# Altium schematic sheet XTIDA-010086_Control Card_28379.SchDoc: Control card
size 558 x 431 mm; Date: Not shown in title block; ApprovedBy: Not shown in title block; CheckedBy: Not shown in title block; Author: Not shown in title block; CompanyName: Not shown in title block; DrawnBy: Jeff Xie; Engineer: Not shown in title block; Organization: Not shown in title block; Address1: Not shown in title block; Address2: Not shown in title block; Address3: Not shown in title block; Address4: Not shown in title block; DocumentNumber: 2; Revision: Use project parameter SCH_Rev; SheetNumber: 6; SheetTotal: 8; PageSetup: Record=PageOptions|CenterHorizontal=True|CenterVertical=True|PrintScale=1.00|XCorrection=1.00|YCorrection=1.00|PrintKind=0|BorderSize=5000000|LeftOffset=0|BottomOffset=0|Orientation=2|PaperLength=1000|PaperWidth=1000|Scale=100|PaperSource=15|PrintQuality=600|MediaType=1|DitherType=10|PaperKind=Letter|PrintScaleMode=1; CurrentTime: Not shown in title block; CurrentDate: Not shown in title block; Time: Not shown in title block; DocumentFullPathAndName: Not shown in title block; DocumentName: Not shown in title block; ModifiedDate: Not shown in title block; ImagePath: Not shown in title block
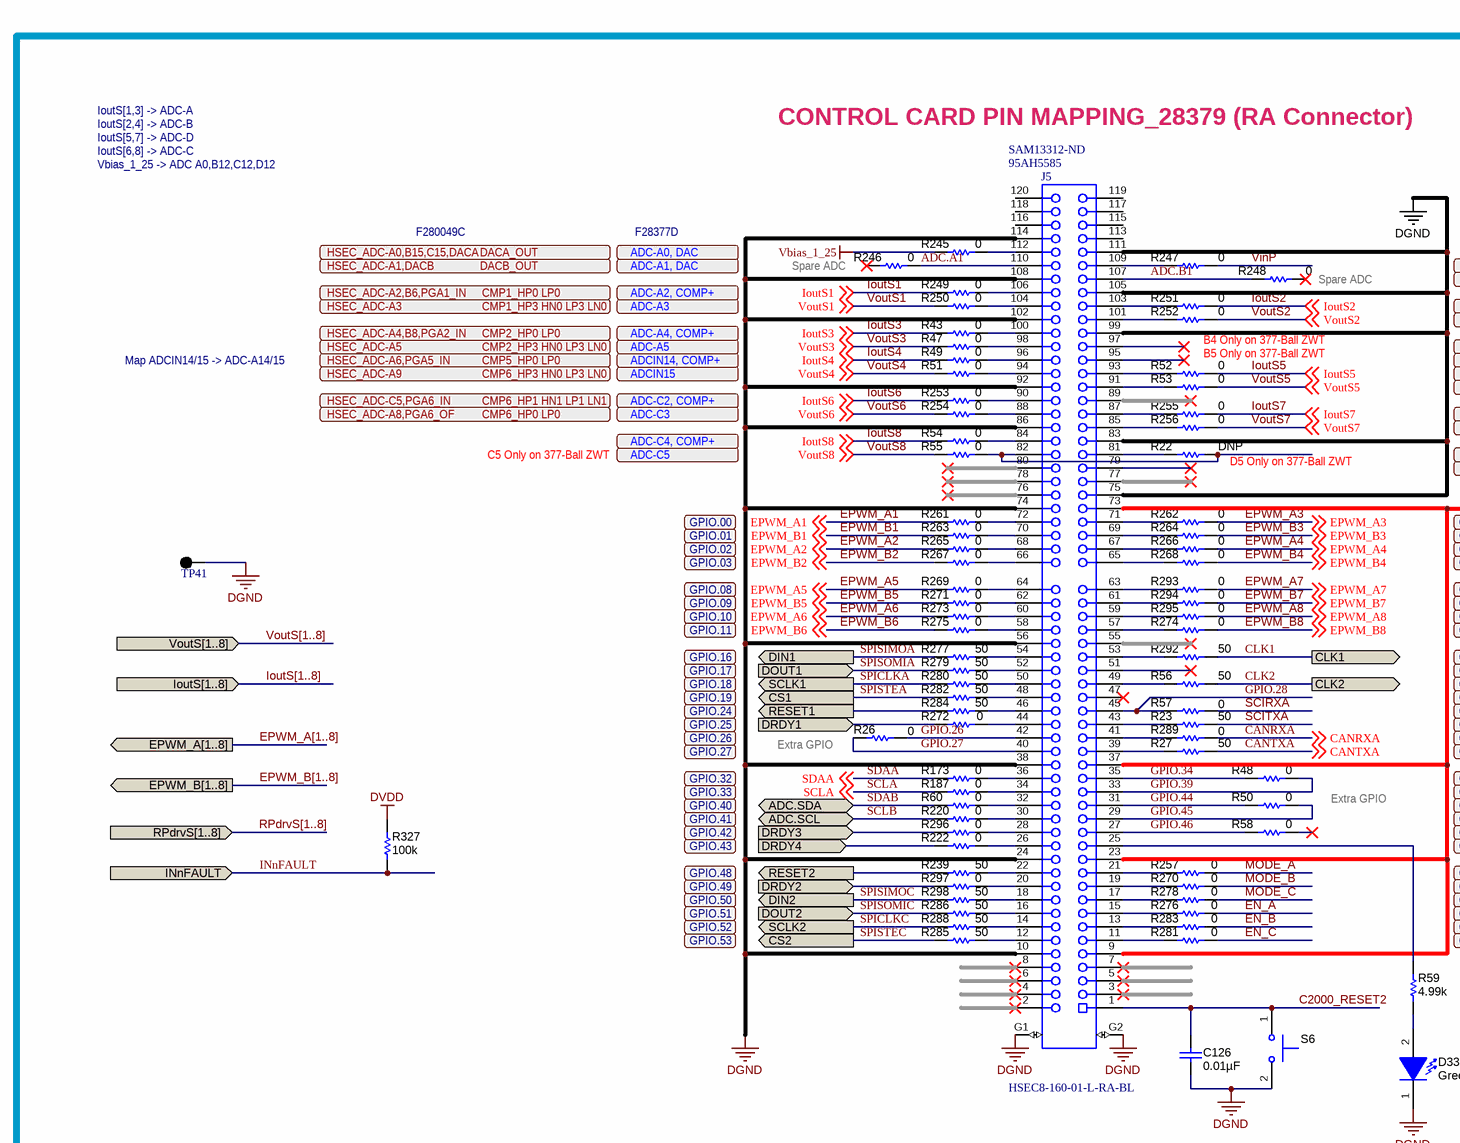
[diagram p0: XTIDA-010086_Control Card_28379.SchDoc, top left]
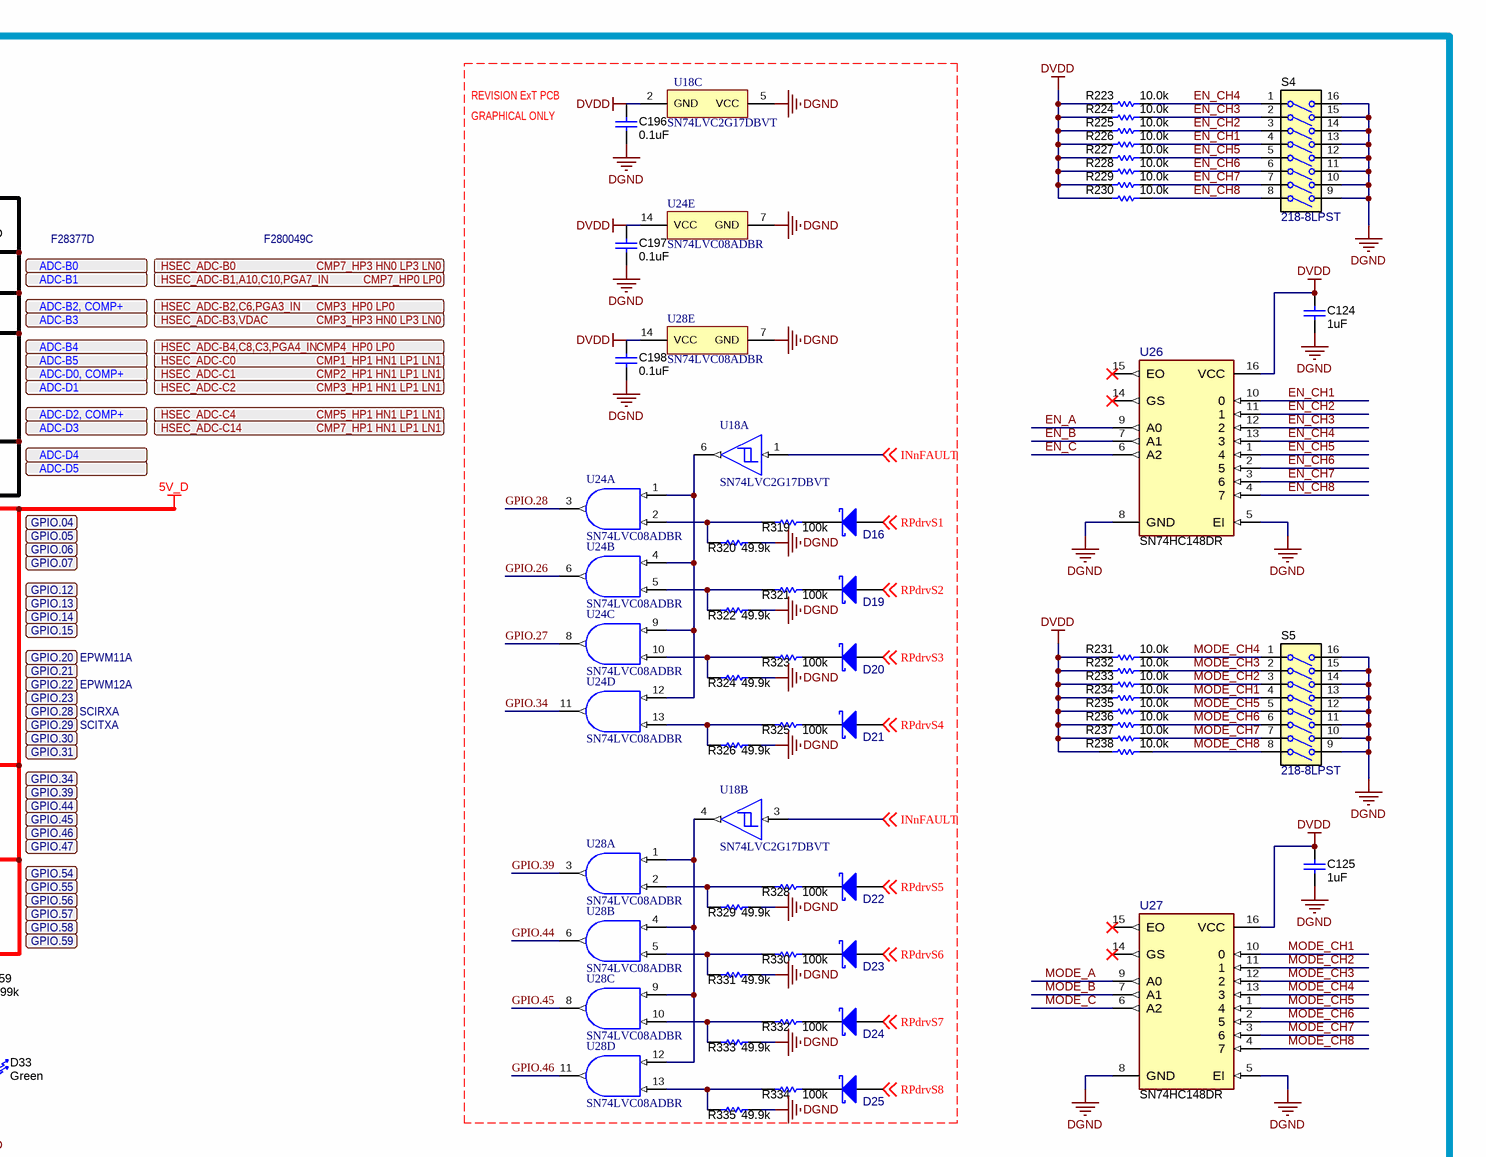
[diagram p1: XTIDA-010086_Control Card_28379.SchDoc, top right]
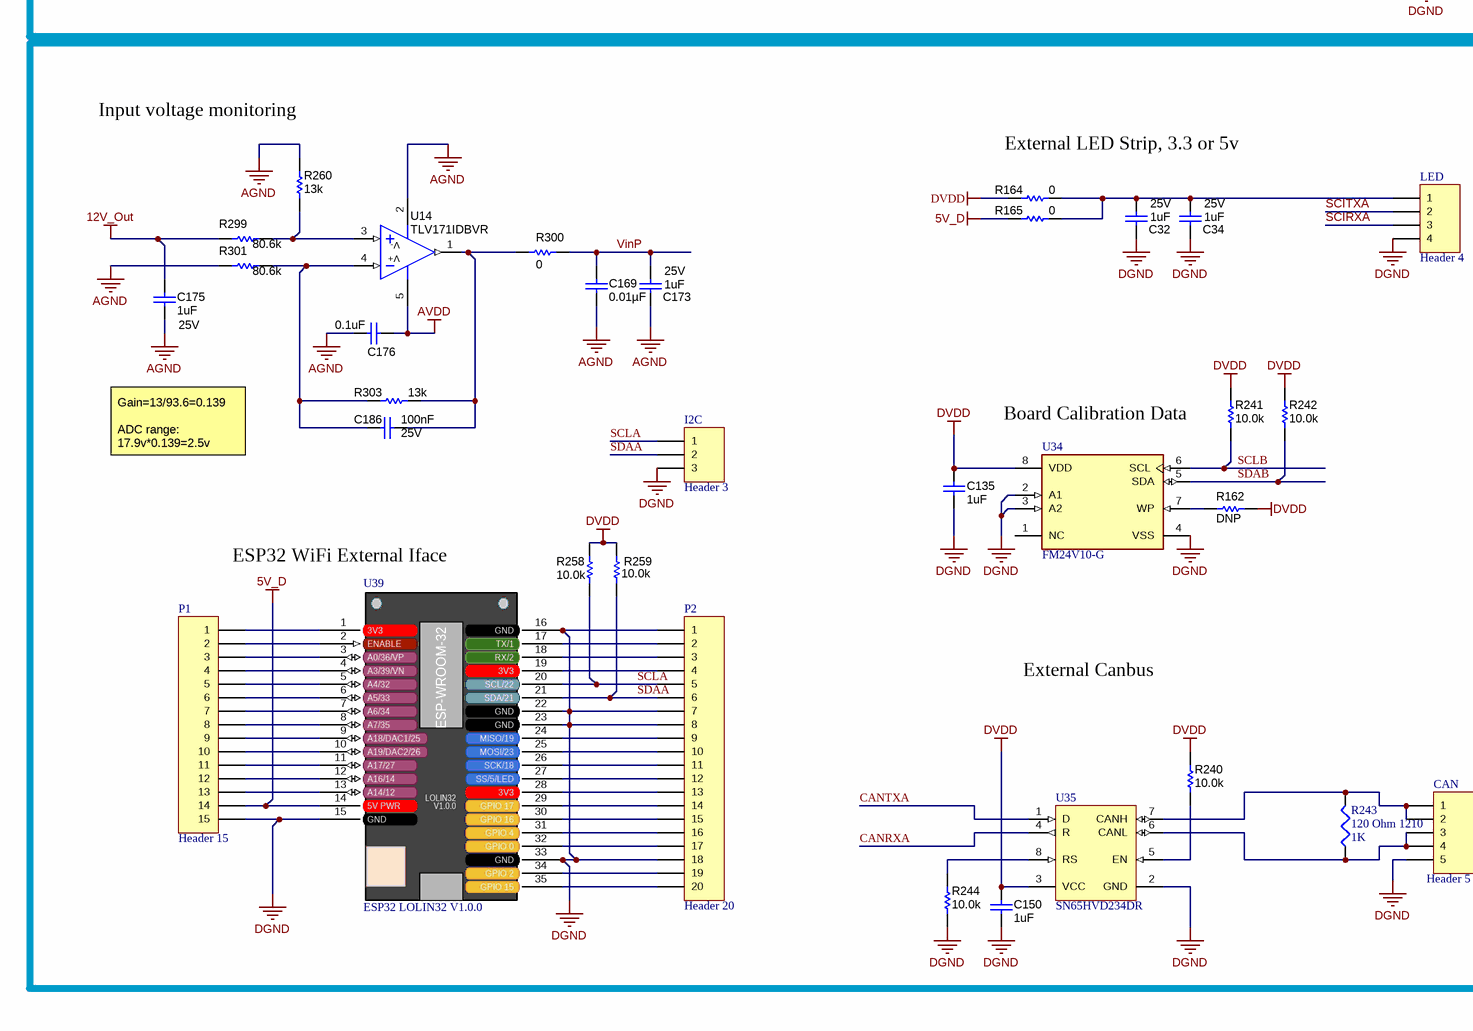
[diagram p2: XTIDA-010086_Control Card_28379.SchDoc, bottom left]
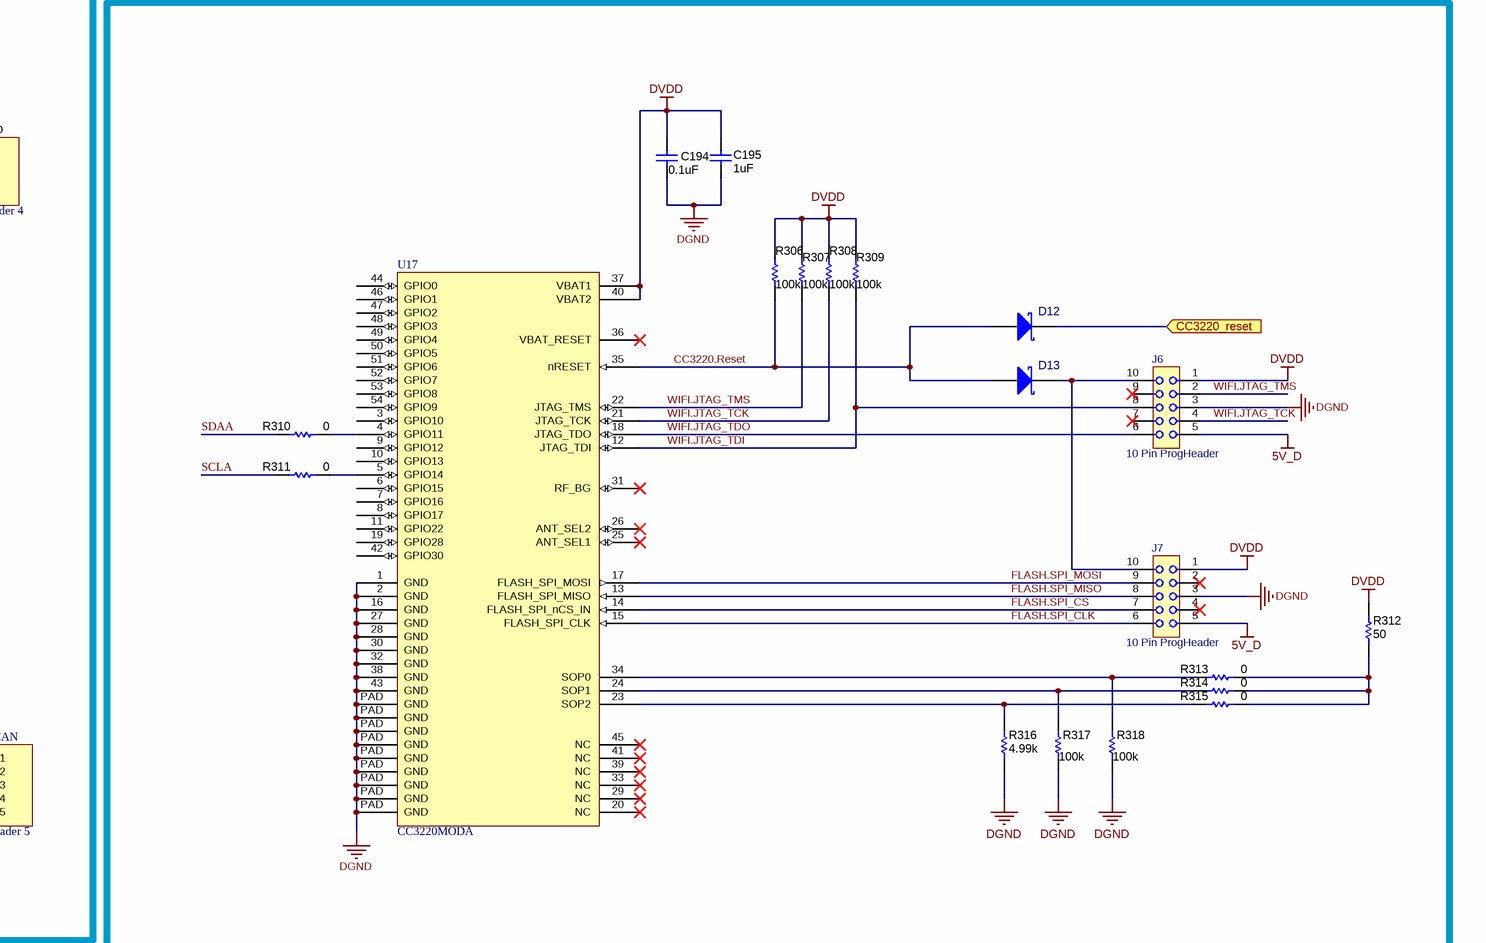
[diagram p3: XTIDA-010086_Control Card_28379.SchDoc, bottom right]

## Parts
C32  ValueDisplayed: 1uF  VDC_V: 25V  [0603]  (hidden comment: GRM188R71E105KA12D)
C34  ValueDisplayed: 1uF  VDC_V: 25V  [0603]  (hidden comment: GRM188R71E105KA12D)
C124  ValueDisplayed: 1uF  [0603]  (hidden comment: GRM188R71E105KA12D)
C125  ValueDisplayed: 1uF  [0603]  (hidden comment: GRM188R71E105KA12D)
C126  ValueDisplayed: 0.01µF  [0603]  (hidden comment: C0603C103J3GECAUTO)
C135  ValueDisplayed: 1uF  [0603]  (hidden comment: GRM188R71E105KA12D)
C150  ValueDisplayed: 1uF  [0603]  (hidden comment: GRM188R71E105KA12D)
C169  ValueDisplayed: 0.01µF  [0603]  (hidden comment: C0603C103J3GECAUTO)
C173  ValueDisplayed: 1uF  VDC_V: 25V  [0603]  (hidden comment: GRM188R71E105KA12D)
C175  ValueDisplayed: 1uF  Value2: 25V  [0603]  (hidden comment: GRM188R71E105KA12D)
C176  ValueDisplayed: 0.1uF  [0603]  (hidden comment: 06033C104JAT2A)
C186  Cap_F: 100nF  Value2: 25V  [0603]  (hidden comment: 06033C104JAT2A)
C194  ValueDisplayed: 0.1uF  [0603]  (hidden comment: 06033C104JAT2A)
C195  ValueDisplayed: 1uF  [0603]  (hidden comment: GRM188R71E105KA12D)
C196  ValueDisplayed: 0.1uF  [0603]  (hidden comment: 06033C104JAT2A)  (graphical)
C197  ValueDisplayed: 0.1uF  [0603]  (hidden comment: 06033C104JAT2A)  (graphical)
C198  ValueDisplayed: 0.1uF  [0603]  (hidden comment: 06033C104JAT2A)  (graphical)
CAN  Header 5  [TERM_BLK_ED555-5DS]
D12  NSR0240V2T1G  [SOD-523]  (value not drawn)
D13  NSR0240V2T1G  [SOD-523]  (value not drawn)
D16  NSR0240V2T1G  [SOD-523]  (value not drawn)  (graphical)
D19  NSR0240V2T1G  [SOD-523]  (value not drawn)  (graphical)
D20  NSR0240V2T1G  [SOD-523]  (value not drawn)  (graphical)
D21  NSR0240V2T1G  [SOD-523]  (value not drawn)  (graphical)
D22  NSR0240V2T1G  [SOD-523]  (value not drawn)  (graphical)
D23  NSR0240V2T1G  [SOD-523]  (value not drawn)  (graphical)
D24  NSR0240V2T1G  [SOD-523]  (value not drawn)  (graphical)
D25  NSR0240V2T1G  [SOD-523]  (value not drawn)  (graphical)
D33  value Green  [WL-SMCW_GREEN]  (hidden comment: 150060VS75000)
I2C  Header 3  [TERM_BLK_ED555-3DS]
J5  HSEC8-160-01-L-RA-BL  Supplier Part Number 1: 95AH5585  Supplier Part Number 2: SAM13312-ND  [HSEC8-160-01-X-RA-BL]
J6  10 Pin ProgHeader  [TC2050-NL-SMD_W/MOUNT]
J7  10 Pin ProgHeader  [TC2050-NL-SMD_W/mount]
LED  Header 4  [TERM_BLK_ED555-4DS]
P1  Header 15  [HDR1X15]
P2  Header 20  [HDR1X20]
R22  ValueDisplayed: DNP  [0402]  (hidden comment: CRCW04020000Z0ED)
R23  ValueDisplayed: 50  [0402]  (hidden comment: FC0402E50R0BST1)
R26  ValueDisplayed: 0  [0402]  (hidden comment: CRCW04020000Z0ED)
R27  ValueDisplayed: 50  [0402]  (hidden comment: FC0402E50R0BST1)
R43  ValueDisplayed: 0  [0402]  (hidden comment: CRCW04020000Z0ED)
R47  ValueDisplayed: 0  [0402]  (hidden comment: CRCW04020000Z0ED)
R48  ValueDisplayed: 0  [0402]  (hidden comment: CRCW04020000Z0ED)
R49  ValueDisplayed: 0  [0402]  (hidden comment: CRCW04020000Z0ED)
R50  ValueDisplayed: 0  [0402]  (hidden comment: CRCW04020000Z0ED)
R51  ValueDisplayed: 0  [0402]  (hidden comment: CRCW04020000Z0ED)
R52  ValueDisplayed: 0  [0402]  (hidden comment: CRCW04020000Z0ED)
R53  ValueDisplayed: 0  [0402]  (hidden comment: CRCW04020000Z0ED)
R54  ValueDisplayed: 0  [0402]  (hidden comment: CRCW04020000Z0ED)
R55  ValueDisplayed: 0  [0402]  (hidden comment: CRCW04020000Z0ED)
R56  ValueDisplayed: 50  [0402]  (hidden comment: FC0402E50R0BST1)
R57  ValueDisplayed: 0  [0402]  (hidden comment: CRCW04020000Z0ED)
R58  ValueDisplayed: 0  [0402]  (hidden comment: CRCW04020000Z0ED)
R59  ValueDisplayed: 4.99k  [0603L]  (hidden comment: CRCW06034K99FKEA)
R60  ValueDisplayed: 0  [0402]  (hidden comment: CRCW04020000Z0ED)
R162  ValueDisplayed: DNP  [0402]  (hidden comment: CRCW04020000Z0ED)
R164  ValueDisplayed: 0  [0402]  (hidden comment: CRCW04020000Z0ED)
R165  ValueDisplayed: 0  [0402]  (hidden comment: CRCW04020000Z0ED)
R173  ValueDisplayed: 0  [0402]  (hidden comment: CRCW04020000Z0ED)
R187  ValueDisplayed: 0  [0402]  (hidden comment: CRCW04020000Z0ED)
R220  ValueDisplayed: 0  [0402]  (hidden comment: CRCW04020000Z0ED)
R222  ValueDisplayed: 0  [0402]  (hidden comment: CRCW04020000Z0ED)
R223  ValueDisplayed: 10.0k  [0402]  (hidden comment: CRCW040210K0FKED)
R224  ValueDisplayed: 10.0k  [0402]  (hidden comment: CRCW040210K0FKED)
R225  ValueDisplayed: 10.0k  [0402]  (hidden comment: CRCW040210K0FKED)
R226  ValueDisplayed: 10.0k  [0402]  (hidden comment: CRCW040210K0FKED)
R227  ValueDisplayed: 10.0k  [0402]  (hidden comment: CRCW040210K0FKED)
R228  ValueDisplayed: 10.0k  [0402]  (hidden comment: CRCW040210K0FKED)
R229  ValueDisplayed: 10.0k  [0402]  (hidden comment: CRCW040210K0FKED)
R230  ValueDisplayed: 10.0k  [0402]  (hidden comment: CRCW040210K0FKED)
R231  ValueDisplayed: 10.0k  [0402]  (hidden comment: CRCW040210K0FKED)
R232  ValueDisplayed: 10.0k  [0402]  (hidden comment: CRCW040210K0FKED)
R233  ValueDisplayed: 10.0k  [0402]  (hidden comment: CRCW040210K0FKED)
R234  ValueDisplayed: 10.0k  [0402]  (hidden comment: CRCW040210K0FKED)
R235  ValueDisplayed: 10.0k  [0402]  (hidden comment: CRCW040210K0FKED)
R236  ValueDisplayed: 10.0k  [0402]  (hidden comment: CRCW040210K0FKED)
R237  ValueDisplayed: 10.0k  [0402]  (hidden comment: CRCW040210K0FKED)
R238  ValueDisplayed: 10.0k  [0402]  (hidden comment: CRCW040210K0FKED)
R239  ValueDisplayed: 50  [0402]  (hidden comment: FC0402E50R0BST1)
R240  ValueDisplayed: 10.0k  [0402]  (hidden comment: CRCW040210K0FKED)
R241  ValueDisplayed: 10.0k  [0402]  (hidden comment: CRCW040210K0FKED)
R242  ValueDisplayed: 10.0k  [0402]  (hidden comment: CRCW040210K0FKED)
R243  120 Ohm 1210  value 1K  [14-1210]
R244  ValueDisplayed: 10.0k  [0402]  (hidden comment: CRCW040210K0FKED)
R245  ValueDisplayed: 0  [0402]  (hidden comment: CRCW04020000Z0ED)
R246  ValueDisplayed: 0  [0402]  (hidden comment: CRCW04020000Z0ED)
R247  ValueDisplayed: 0  [0402]  (hidden comment: CRCW04020000Z0ED)
R248  ValueDisplayed: 0  [0402]  (hidden comment: CRCW04020000Z0ED)
R249  ValueDisplayed: 0  [0402]  (hidden comment: CRCW04020000Z0ED)
R250  ValueDisplayed: 0  [0402]  (hidden comment: CRCW04020000Z0ED)
R251  ValueDisplayed: 0  [0402]  (hidden comment: CRCW04020000Z0ED)
R252  ValueDisplayed: 0  [0402]  (hidden comment: CRCW04020000Z0ED)
R253  ValueDisplayed: 0  [0402]  (hidden comment: CRCW04020000Z0ED)
R254  ValueDisplayed: 0  [0402]  (hidden comment: CRCW04020000Z0ED)
R255  ValueDisplayed: 0  [0402]  (hidden comment: CRCW04020000Z0ED)
R256  ValueDisplayed: 0  [0402]  (hidden comment: CRCW04020000Z0ED)
R257  ValueDisplayed: 0  [0402]  (hidden comment: CRCW04020000Z0ED)
R258  ValueDisplayed: 10.0k  [0402]  (hidden comment: CRCW040210K0FKED)
R259  ValueDisplayed: 10.0k  [0402]  (hidden comment: CRCW040210K0FKED)
R260  ValueDisplayed: 13k  [0603]  (hidden comment: ERJ-3EKF1302V)
R261  ValueDisplayed: 0  [0402]  (hidden comment: CRCW04020000Z0ED)
R262  ValueDisplayed: 0  [0402]  (hidden comment: CRCW04020000Z0ED)
R263  ValueDisplayed: 0  [0402]  (hidden comment: CRCW04020000Z0ED)
R264  ValueDisplayed: 0  [0402]  (hidden comment: CRCW04020000Z0ED)
R265  ValueDisplayed: 0  [0402]  (hidden comment: CRCW04020000Z0ED)
R266  ValueDisplayed: 0  [0402]  (hidden comment: CRCW04020000Z0ED)
R267  ValueDisplayed: 0  [0402]  (hidden comment: CRCW04020000Z0ED)
R268  ValueDisplayed: 0  [0402]  (hidden comment: CRCW04020000Z0ED)
R269  ValueDisplayed: 0  [0402]  (hidden comment: CRCW04020000Z0ED)
R270  ValueDisplayed: 0  [0402]  (hidden comment: CRCW04020000Z0ED)
R271  ValueDisplayed: 0  [0402]  (hidden comment: CRCW04020000Z0ED)
R272  ValueDisplayed: 0  [0402]  (hidden comment: CRCW04020000Z0ED)
R273  ValueDisplayed: 0  [0402]  (hidden comment: CRCW04020000Z0ED)
R274  ValueDisplayed: 0  [0402]  (hidden comment: CRCW04020000Z0ED)
R275  ValueDisplayed: 0  [0402]  (hidden comment: CRCW04020000Z0ED)
R276  ValueDisplayed: 0  [0402]  (hidden comment: CRCW04020000Z0ED)
R277  ValueDisplayed: 50  [0402]  (hidden comment: FC0402E50R0BST1)
R278  ValueDisplayed: 0  [0402]  (hidden comment: CRCW04020000Z0ED)
R279  ValueDisplayed: 50  [0402]  (hidden comment: FC0402E50R0BST1)
R280  ValueDisplayed: 50  [0402]  (hidden comment: FC0402E50R0BST1)
R281  ValueDisplayed: 0  [0402]  (hidden comment: CRCW04020000Z0ED)
R282  ValueDisplayed: 50  [0402]  (hidden comment: FC0402E50R0BST1)
R283  ValueDisplayed: 0  [0402]  (hidden comment: CRCW04020000Z0ED)
R284  ValueDisplayed: 50  [0402]  (hidden comment: FC0402E50R0BST1)
R285  ValueDisplayed: 50  [0402]  (hidden comment: FC0402E50R0BST1)
R286  ValueDisplayed: 50  [0402]  (hidden comment: FC0402E50R0BST1)
R288  ValueDisplayed: 50  [0402]  (hidden comment: FC0402E50R0BST1)
R289  ValueDisplayed: 0  [0402]  (hidden comment: CRCW04020000Z0ED)
R292  ValueDisplayed: 50  [0402]  (hidden comment: FC0402E50R0BST1)
R293  ValueDisplayed: 0  [0402]  (hidden comment: CRCW04020000Z0ED)
R294  ValueDisplayed: 0  [0402]  (hidden comment: CRCW04020000Z0ED)
R295  ValueDisplayed: 0  [0402]  (hidden comment: CRCW04020000Z0ED)
R296  ValueDisplayed: 0  [0402]  (hidden comment: CRCW04020000Z0ED)
R297  ValueDisplayed: 0  [0402]  (hidden comment: CRCW04020000Z0ED)
R298  ValueDisplayed: 50  [0402]  (hidden comment: FC0402E50R0BST1)
R299  ValueDisplayed: 80.6k  [0603]  (hidden comment: RG1608P-8062-B-T5)
R300  ValueDisplayed: 0  [0402]  (hidden comment: CRCW04020000Z0ED)
R301  ValueDisplayed: 80.6k  [0603]  (hidden comment: RG1608P-8062-B-T5)
R303  ValueDisplayed: 13k  [0603]  (hidden comment: ERJ-3EKF1302V)
R306  ValueDisplayed: 100k  [0603]  (hidden comment: RC0603FR-07100KL)
R307  ValueDisplayed: 100k  [0603]  (hidden comment: RC0603FR-07100KL)
R308  ValueDisplayed: 100k  [0603]  (hidden comment: RC0603FR-07100KL)
R309  ValueDisplayed: 100k  [0603]  (hidden comment: RC0603FR-07100KL)
R310  ValueDisplayed: 0  [0402]  (hidden comment: CRCW04020000Z0ED)
R311  ValueDisplayed: 0  [0402]  (hidden comment: CRCW04020000Z0ED)
R312  ValueDisplayed: 50  [0402]  (hidden comment: FC0402E50R0BST1)
R313  ValueDisplayed: 0  [0402]  (hidden comment: CRCW04020000Z0ED)
R314  ValueDisplayed: 0  [0402]  (hidden comment: CRCW04020000Z0ED)
R315  ValueDisplayed: 0  [0402]  (hidden comment: CRCW04020000Z0ED)
R316  ValueDisplayed: 4.99k  [0603L]  (hidden comment: CRCW06034K99FKEA)
R317  ValueDisplayed: 100k  [0603]  (hidden comment: RC0603FR-07100KL)
R318  ValueDisplayed: 100k  [0603]  (hidden comment: RC0603FR-07100KL)
R319  ValueDisplayed: 100k  [0603]  (hidden comment: RT0603BRD07100KL)  (graphical)
R320  ValueDisplayed: 49.9k  [0603]  (hidden comment: CRCW060349K9FKEA)  (graphical)
R321  ValueDisplayed: 100k  [0603]  (hidden comment: RT0603BRD07100KL)  (graphical)
R322  ValueDisplayed: 49.9k  [0603]  (hidden comment: CRCW060349K9FKEA)  (graphical)
R323  ValueDisplayed: 100k  [0603]  (hidden comment: RT0603BRD07100KL)  (graphical)
R324  ValueDisplayed: 49.9k  [0603]  (hidden comment: CRCW060349K9FKEA)  (graphical)
R325  ValueDisplayed: 100k  [0603]  (hidden comment: RT0603BRD07100KL)  (graphical)
R326  ValueDisplayed: 49.9k  [0603]  (hidden comment: CRCW060349K9FKEA)  (graphical)
R327  ValueDisplayed: 100k  [0603]  (hidden comment: RT0603BRD07100KL)
R328  ValueDisplayed: 100k  [0603]  (hidden comment: RT0603BRD07100KL)  (graphical)
R329  ValueDisplayed: 49.9k  [0603]  (hidden comment: CRCW060349K9FKEA)  (graphical)
R330  ValueDisplayed: 100k  [0603]  (hidden comment: RT0603BRD07100KL)  (graphical)
R331  ValueDisplayed: 49.9k  [0603]  (hidden comment: CRCW060349K9FKEA)  (graphical)
R332  ValueDisplayed: 100k  [0603]  (hidden comment: RT0603BRD07100KL)  (graphical)
R333  ValueDisplayed: 49.9k  [0603]  (hidden comment: CRCW060349K9FKEA)  (graphical)
R334  ValueDisplayed: 100k  [0603]  (hidden comment: RT0603BRD07100KL)  (graphical)
R335  ValueDisplayed: 49.9k  [0603]  (hidden comment: CRCW060349K9FKEA)  (graphical)
S4  218-8LPST  [SW_218-8LP]
S5  218-8LPST  [SW_218-8LP]
S6  Switch_PushButton  [SW_TL1015AF160QG]  (value not drawn)
TP41  5001  [Keystone5001]  (value not drawn)
U14  TLV171IDBVR  [DBV0005A_N]
U17  CC3220MODA  [CC3220MODASF12MONR]
U18  SN74LVC2G17DBVT  [DBV0006A_N]  (parts A,B,C of 3)  (graphical)
U24  SN74LVC08ADBR  [DB0014A_M]  (parts A,B,C,D,E of 5)  (graphical)
U26  SN74HC148DR  [D0016A-MFG]
U27  SN74HC148DR  [D0016A-MFG]
U28  SN74LVC08ADBR  [DB0014A_M]  (parts A,B,C,D,E of 5)  (graphical)
U34  FM24V10-G  [FP-51-85066-IPC_A]
U35  SN65HVD234DR  [D0008A_M]
U39  ESP32 LOLIN32 V1.0.0  [ESP32_LOLIN32_V1]

## Blocks framed on the sheet
CONTROL CARD PIN MAPPING_28379 (RA Connector): C124-C126 C196-C198 D16 D19-D25 D33 J5 R22 R23 R26 R27 R43 R47-R60 R173 R187 R220 R222-R239 R245-R257 R261-R286 R288 R289 R292-R298 R319-R335 S4-S6 TP41 U18 U24 U26-U28

## Ports
ADC.SCL (bidir), ADC.SDA (bidir), CC3220_reset (in), CLK1 (out), CLK2 (out), CS1 (out), CS2 (out), DIN1 (out), DIN2 (out), DOUT1 (in), DOUT2 (in), DRDY1 (in), DRDY2 (in), DRDY3 (in), DRDY4 (in), EPWM_A[1..8] (out), EPWM_B[1..8] (out), INnFAULT (in), IoutS[1..8] (in), RESET1 (out), RESET2 (out), RPdrvS[1..8] (in), SCLK1 (out), SCLK2 (out), VoutS[1..8] (in)

## Nets
5V_D: J5.9 J5.23 J5.37 J5.73 J6.5 J7.5 P1.14 R165.1 U39.14(5V_PWR)
12V_Out: C175.1 R299.1
AGND: C169.2 C173.1 C175.2 C176.2 R260.2 R301.1 U14.2(V-)
AVDD: C176.1 U14.5(V+)
DGND: C32.1 C34.1 C124.2 C125.2 C126.2 C135.2 C150.2 C194.2 C195.2 C196.2 C197.2 C198.2 CAN.5 D33.1(K) I2C.3 J5.10 J5.24 J5.38 J5.56 J5.74 J5.75 J5.83 J5.86 J5.92 J5.99 J5.102 J5.105 J5.108 J5.111 J5.114 J5.G1 J5.G2 J6.3 J7.3 LED.4 P1.15 P2.1 P2.7 P2.8 P2.18 R244.1 R316.2 R317.1 R318.1 R320.1 R322.1 R324.1 R326.1 R329.1 R331.1 R333.1 R335.1 S4.9(8A) S4.10(7A) S4.11(6A) S4.12(5A) S4.13(4A) S4.14(3A) S4.15(2A) S4.16(1A) S5.9(8A) S5.10(7A) S5.11(6A) S5.12(5A) S5.13(4A) S5.14(3A) S5.15(2A) S5.16(1A) S6.2 TP41.1 U17.1(GND) U17.2(GND) U17.16(GND) U17.27(GND) U17.28(GND) U17.30(GND) U17.32(GND) U17.38(GND) U17.43(GND) U17.PAD(GND) U18.5(VCC) U24.7(GND) U26.5(EI) U26.8(GND) U27.5(EI) U27.8(GND) U28.7(GND) U34.2(A1) U34.3(A2) U34.4(VSS) U35.2(GND) U39.15(GND) U39.16(GND) U39.22(GND) U39.23(GND) U39.33(GND)
DVDD: C124.1 C125.1 C135.1 C150.1 C194.1 C195.1 C196.1 C197.1 C198.1 J6.1 J7.1 R162.1 R164.1 R223.1 R224.1 R225.1 R226.1 R227.1 R228.1 R229.1 R230.1 R231.1 R232.1 R233.1 R234.1 R235.1 R236.1 R237.1 R238.1 R240.2 R241.2 R242.2 R258.2 R259.2 R306.2 R307.2 R308.2 R309.2 R312.2 R327.2 U17.37(VBAT1) U17.40(VBAT2) U18.2(GND) U24.14(VCC) U26.16(VCC) U27.16(VCC) U28.14(VCC) U34.8(VDD) U35.3(VCC)
Vbias_1_25: R245.1
ADC.A1: J5.110 R246.2
ADC.B1: J5.107 R248.2
C2000_RESET2: C126.1 J5.1 S6.1
CANRXA: R289.1 U35.4(R) ; off-sheet CANRXA
CANTXA: R27.1 U35.1(D) ; off-sheet CANTXA
CC3220.Reset: D12.2(A) D13.2(A) R306.1 U17.35(nRESET)
CC3220_reset: D12.1(K) ; port CC3220_reset
CLK1: R292.2 ; port CLK1
CLK2: R56.2 ; port CLK2
DRDY1: R272.2 ; port DRDY1
DRDY2: R297.1 ; port DRDY2
DRDY3: R296.2 ; port DRDY3
DRDY4: R222.2 ; port DRDY4
EN_A: R276.1 U26.9(A0)
EN_B: R283.1 U26.7(A1)
EN_C: R281.2 U26.6(A2)
EN_CH1: R226.2 S4.4 U26.10(0)
EN_CH2: R225.2 S4.3 U26.11(1)
EN_CH3: R224.2 S4.2 U26.12(2)
EN_CH4: R223.2 S4.1 U26.13(3)
EN_CH5: R227.2 S4.5 U26.1(4)
EN_CH6: R228.2 S4.6 U26.2(5)
EN_CH7: R229.2 S4.7 U26.3(6)
EN_CH8: R230.2 S4.8 U26.4(7)
EPWM_A1: R261.1 ; off-sheet EPWM_A1
EPWM_A2: R265.1 ; off-sheet EPWM_A2
EPWM_A3: R262.1 ; off-sheet EPWM_A3
EPWM_A4: R266.1 ; off-sheet EPWM_A4
EPWM_A5: R269.1 ; off-sheet EPWM_A5
EPWM_A6: R273.1 ; off-sheet EPWM_A6
EPWM_A7: R293.2 ; off-sheet EPWM_A7
EPWM_A8: R295.2 ; off-sheet EPWM_A8
EPWM_B1: R263.1 ; off-sheet EPWM_B1
EPWM_B2: R267.1 ; off-sheet EPWM_B2
EPWM_B3: R264.1 ; off-sheet EPWM_B3
EPWM_B4: R268.1 ; off-sheet EPWM_B4
EPWM_B5: R271.1 ; off-sheet EPWM_B5
EPWM_B6: R275.1 ; off-sheet EPWM_B6
EPWM_B7: R294.2 ; off-sheet EPWM_B7
EPWM_B8: R274.1 ; off-sheet EPWM_B8
FLASH.SPI_CLK: J7.6 U17.15(FLASH_SPI_CLK)
FLASH.SPI_CS: J7.7 U17.14(FLASH_SPI_nCS_IN)
FLASH.SPI_MISO: J7.8 U17.13(FLASH_SPI_MISO)
FLASH.SPI_MOSI: J7.9 U17.17(FLASH_SPI_MOSI)
GPIO.26: J5.42 R26.1 U24.6(2Y)
GPIO.27: J5.40 R26.2 U24.8(3Y)
GPIO.28: J5.45 R57.2 U24.3(1Y)
GPIO.34: J5.35 R48.2 U24.11(4Y)
GPIO.39: J5.33 R48.1 U28.3(1Y)
GPIO.44: J5.31 R50.2 U28.6(2Y)
GPIO.45: J5.29 R50.1 U28.8(3Y)
GPIO.46: J5.27 R58.2 U28.11(4Y)
INnFAULT: R327.1 U18.1(1A) U18.3(2A) ; off-sheet INnFAULT, port INnFAULT
IoutS1: R249.1 ; off-sheet IoutS1
IoutS2: R251.1 ; off-sheet IoutS2
IoutS3: R43.1 ; off-sheet IoutS3
IoutS4: R49.1 ; off-sheet IoutS4
IoutS5: R52.1 ; off-sheet IoutS5
IoutS6: R253.1 ; off-sheet IoutS6
IoutS7: R255.1 ; off-sheet IoutS7
IoutS8: R54.1 ; off-sheet IoutS8
MODE_A: R257.1 U27.9(A0)
MODE_B: R270.1 U27.7(A1)
MODE_C: R278.1 U27.6(A2)
MODE_CH1: R234.2 S5.4 U27.10(0)
MODE_CH2: R233.2 S5.3 U27.11(1)
MODE_CH3: R232.2 S5.2 U27.12(2)
MODE_CH4: R231.2 S5.1 U27.13(3)
MODE_CH5: R235.2 S5.5 U27.1(4)
MODE_CH6: R236.2 S5.6 U27.2(5)
MODE_CH7: R237.2 S5.7 U27.3(6)
MODE_CH8: R238.2 S5.8 U27.4(7)
RESET1: R284.1 ; port RESET1
RESET2: R239.1 ; port RESET2
RPdrvS1: D16.2(A) ; off-sheet RPdrvS1
RPdrvS2: D19.2(A) ; off-sheet RPdrvS2
RPdrvS3: D20.2(A) ; off-sheet RPdrvS3
RPdrvS4: D21.2(A) ; off-sheet RPdrvS4
RPdrvS5: D22.2(A) ; off-sheet RPdrvS5
RPdrvS6: D23.2(A) ; off-sheet RPdrvS6
RPdrvS7: D24.2(A) ; off-sheet RPdrvS7
RPdrvS8: D25.2(A) ; off-sheet RPdrvS8
SCIRXA: LED.3 R57.1
SCITXA: LED.2 R23.1
SCLA: I2C.1 P2.5 R187.2 R258.1 R311.2 U39.20(SCL/22) ; off-sheet SCLA
SCLB: R220.2 R241.1 U34.6(SCL) ; port ADC.SCL
SDAA: I2C.2 P2.6 R173.2 R259.1 R310.2 U39.21(SDA/21) ; off-sheet SDAA
SDAB: R60.2 R242.1 U34.5(SDA) ; port ADC.SDA
SPICLKA: R280.2 ; port SCLK1
SPICLKC: R288.1 ; port SCLK2
SPISIMOA: R277.1 ; port DIN1
SPISIMOC: R298.1 ; port DIN2
SPISOMIA: R279.1 ; port DOUT1
SPISOMIC: R286.1 ; port DOUT2
SPISTEA: R282.2 ; port CS1
SPISTEC: R285.2 ; port CS2
VinP: C169.1 C173.2 R247.1 R300.2
VoutS1: R250.1 ; off-sheet VoutS1
VoutS2: R252.1 ; off-sheet VoutS2
VoutS3: R47.1 ; off-sheet VoutS3
VoutS4: R51.1 ; off-sheet VoutS4
VoutS5: R53.1 ; off-sheet VoutS5
VoutS6: R254.1 ; off-sheet VoutS6
VoutS7: R256.1 ; off-sheet VoutS7
VoutS8: R55.1 ; off-sheet VoutS8
WIFI.JTAG_TCK: J6.4 R308.1 U17.21(JTAG_TCK)
WIFI.JTAG_TDI: J6.8 R309.1 U17.12(JTAG_TDI)
WIFI.JTAG_TDO: J6.6 U17.18(JTAG_TDO)
WIFI.JTAG_TMS: J6.2 R307.1 U17.22(JTAG_TMS)
NetC32_2: C32.2 C34.2 LED.1 R164.2 R165.2
NetC186_1: C186.1 R301.2 R303.2 U14.4(IN-)
NetC186_2: C186.2 R300.1 R303.1 U14.1(OUT)
NetCAN_1: CAN.1 CAN.2 R243.2 U35.7(CANH)
NetCAN_3: CAN.3 CAN.4 R243.1 U35.6(CANL)
NetD13_1: D13.1(K) J6.10 J7.10
NetD16_1: D16.1(K) R319.2
NetD19_1: D19.1(K) R321.2
NetD20_1: D20.1(K) R323.2
NetD21_1: D21.1(K) R325.2
NetD22_1: D22.1(K) R328.2
NetD23_1: D23.1(K) R330.2
NetD24_1: D24.1(K) R332.2
NetD25_1: D25.1(K) R334.2
NetD33_2: D33.2(A) R59.2
NetJ5_11: J5.11 R281.1
NetJ5_12: J5.12 R285.1
NetJ5_13: J5.13 R283.2
NetJ5_14: J5.14 R288.2
NetJ5_15: J5.15 R276.2
NetJ5_16: J5.16 R286.2
NetJ5_17: J5.17 R278.2
NetJ5_18: J5.18 R298.2
NetJ5_19: J5.19 R270.2
NetJ5_20: J5.20 R297.2
NetJ5_21: J5.21 R257.2
NetJ5_22: J5.22 R239.2
NetJ5_25: J5.25 R59.1
NetJ5_26: J5.26 R222.1
NetJ5_28: J5.28 R296.1
NetJ5_30: J5.30 R220.1
NetJ5_32: J5.32 R60.1
NetJ5_34: J5.34 R187.1
NetJ5_36: J5.36 R173.1
NetJ5_39: J5.39 R27.2
NetJ5_41: J5.41 R289.2
NetJ5_43: J5.43 R23.2
NetJ5_44: J5.44 R272.1
NetJ5_46: J5.46 R284.2
NetJ5_48: J5.48 R282.1
NetJ5_49: J5.49 R56.1
NetJ5_50: J5.50 R280.1
NetJ5_52: J5.52 R279.2
NetJ5_53: J5.53 R292.1
NetJ5_54: J5.54 R277.2
NetJ5_57: J5.57 R274.2
NetJ5_58: J5.58 R275.2
NetJ5_59: J5.59 R295.1
NetJ5_60: J5.60 R273.2
NetJ5_61: J5.61 R294.1
NetJ5_62: J5.62 R271.2
NetJ5_63: J5.63 R293.1
NetJ5_64: J5.64 R269.2
NetJ5_65: J5.65 R268.2
NetJ5_66: J5.66 R267.2
NetJ5_67: J5.67 R266.2
NetJ5_68: J5.68 R265.2
NetJ5_69: J5.69 R264.2
NetJ5_70: J5.70 R263.2
NetJ5_71: J5.71 R262.2
NetJ5_72: J5.72 R261.2
NetJ5_81: J5.81 R22.2
NetJ5_82: J5.82 R22.1 R55.2
NetJ5_84: J5.84 R54.2
NetJ5_85: J5.85 R256.2
NetJ5_87: J5.87 R255.2
NetJ5_88: J5.88 R254.2
NetJ5_90: J5.90 R253.2
NetJ5_91: J5.91 R53.2
NetJ5_93: J5.93 R52.2
NetJ5_94: J5.94 R51.2
NetJ5_96: J5.96 R49.2
NetJ5_98: J5.98 R47.2
NetJ5_100: J5.100 R43.2
NetJ5_101: J5.101 R252.2
NetJ5_103: J5.103 R251.2
NetJ5_104: J5.104 R250.2
NetJ5_106: J5.106 R249.2
NetJ5_109: J5.109 R247.2
NetJ5_112: J5.112 R245.2
NetP1_1: P1.1 U39.1(3V3)
NetP1_2: P1.2 U39.2(ENABLE)
NetP1_3: P1.3 U39.3(A0/36/VP)
NetP1_4: P1.4 U39.4(A3/39/VN)
NetP1_5: P1.5 U39.5(A4/32)
NetP1_6: P1.6 U39.6(A5/33)
NetP1_7: P1.7 U39.7(A6/34)
NetP1_8: P1.8 U39.8(A7/35)
NetP1_9: P1.9 U39.9(A18/DAC1/25)
NetP1_10: P1.10 U39.10(A19/DAC2/26)
NetP1_11: P1.11 U39.11(A17/27)
NetP1_12: P1.12 U39.12(A16/14)
NetP1_13: P1.13 U39.13(A14/12)
NetP2_2: P2.2 U39.17(TX/1)
NetP2_3: P2.3 U39.18(RX/2)
NetP2_4: P2.4 U39.19(3V3)
NetP2_9: P2.9 U39.24(MISO/19)
NetP2_10: P2.10 U39.25(MOSI/23)
NetP2_11: P2.11 U39.26(SCK/18)
NetP2_12: P2.12 U39.27(SS/5/LED)
NetP2_13: P2.13 U39.28(3V3)
NetP2_14: P2.14 U39.29(GPIO_17)
NetP2_15: P2.15 U39.30(GPIO_16)
NetP2_16: P2.16 U39.31(GPIO_4)
NetP2_17: P2.17 U39.32(GPIO_0)
NetP2_19: P2.19 U39.34(GPIO_2)
NetP2_20: P2.20 U39.35(GPIO_15)
NetR162_2: R162.2 U34.7(WP)
NetR240_1: R240.1 U35.5(EN)
NetR244_2: R244.2 U35.8(RS)
NetR260_1: R260.1 R299.2 U14.3(IN+)
NetR310_1: R310.1 U17.4(GPIO11)
NetR311_1: R311.1 U17.5(GPIO14)
NetR312_1: R312.1 R313.1 R314.1 R315.1
NetR313_2: R313.2 R318.2 U17.34(SOP0)
NetR314_2: R314.2 R317.2 U17.24(SOP1)
NetR315_2: R315.2 R316.1 U17.23(SOP2)
NetR319_1: R319.1 R320.2 U24.2(1B)
NetR321_1: R321.1 R322.2 U24.5(2B)
NetR323_1: R323.1 R324.2 U24.10(3B)
NetR325_1: R325.1 R326.2 U24.13(4B)
NetR328_1: R328.1 R329.2 U28.2(1B)
NetR330_1: R330.1 R331.2 U28.5(2B)
NetR332_1: R332.1 R333.2 U28.10(3B)
NetR334_1: R334.1 R335.2 U28.13(4B)
NetU18_4: U18.4(2Y) U28.1(1A) U28.4(2A) U28.9(3A) U28.12(4A)
NetU18_6: U18.6(1Y) U24.1(1A) U24.4(2A) U24.9(3A) U24.12(4A)

Not connected (* = marked no-connect by the designer): J5 2* 3* 4* 5* 6* 7* 8* 47* 51* 55* 76* 77* 78* 79* 80* 89* 95* 97* 113 115 116 117 118 119 120; J6 7* 9*; J7 2* 4*; R58 1*; R246 1*; R248 1*; U17 3(GPIO10) 6(GPIO15) 7(GPIO16) 8(GPIO17) 9(GPIO12) 10(GPIO13) 11(GPIO22) 19(GPIO28) 20(NC)* 25(ANT_SEL1)* 26(ANT_SEL2)* 29(NC)* 31(RF_BG)* 33(NC)* 36(VBAT_RESET)* 39(NC)* 41(NC)* 42(GPIO30) 44(GPIO0) 45(NC)* 46(GPIO1) 47(GPIO2) 48(GPIO3) 49(GPIO4) 50(GPIO5) 51(GPIO6) 52(GPIO7) 53(GPIO8) 54(GPIO9); U26 14(GS)* 15(EO)*; U27 14(GS)* 15(EO)*; U34 1(NC)

## Buses and harness runs
bus EPWM_A[1..8] = port EPWM_A[1..8]
bus EPWM_B[1..8] = port EPWM_B[1..8]
bus IoutS[1..8] = port IoutS[1..8]
bus RPdrvS[1..8] = port RPdrvS[1..8]
bus VoutS[1..8] = port VoutS[1..8]

## Notes on the sheet
- IoutS[1,3] -> ADC-A
- IoutS[2,4] -> ADC-B
- IoutS[5,7] -> ADC-D
- REVISION ExT PCB
- GRAPHICAL ONLY
- IoutS[6,8] -> ADC-C
- Vbias_1_25 -> ADC A0,B12,C12,D12
- HSEC_ADC-A0,B15,C15,DACA
- HSEC_ADC-A1,DACB
- F280049C
- DACB_OUT
- DACA_OUT
- ADC-A0, DAC
- ADC-A1, DAC
- F28377D
- (near R246) Spare ADC
- ADC-B0
- HSEC_ADC-B0
- CMP7_HP3 HN0 LP3 LN0
- HSEC_ADC-A2,B6,PGA1_IN
- HSEC_ADC-A3
- HSEC_ADC-A4,B8,PGA2_IN
- CMP1_HP0 LP0
- CMP1_HP3 HN0 LP3 LN0
- CMP2_HP0 LP0
- ADC-A2, COMP+
- ADC-A3
- ADC-A4, COMP+
- (near R248) Spare ADC
- ADC-B1
- ADC-B2, COMP+
- ADC-B3
- HSEC_ADC-B1,A10,C10,PGA7_IN
- HSEC_ADC-B2,C6,PGA3_IN
- HSEC_ADC-B3,VDAC
- CMP3_HP3 HN0 LP3 LN0
- CMP3_HP0 LP0
- CMP7_HP0 LP0
- Map ADCIN14/15 -> ADC-A14/15
- HSEC_ADC-A5
- HSEC_ADC-A6,PGA5_IN
- HSEC_ADC-A9
- HSEC_ADC-C5,PGA6_IN
- CMP6_HP1 HN1 LP1 LN1
- CMP2_HP3 HN0 LP3 LN0
- CMP5_HP0 LP0
- CMP6_HP3 HN0 LP3 LN0
- ADC-A5
- ADCIN14, COMP+
- ADCIN15
- ADC-C2, COMP+
- (near R252) B4 Only on 377-Ball ZWT
- (near R52) B5 Only on 377-Ball ZWT
- ADC-B4
- ADC-B5
- ADC-D0, COMP+
- ADC-D1
- HSEC_ADC-B4,C8,C3,PGA4_IN
- HSEC_ADC-C0
- HSEC_ADC-C1
- HSEC_ADC-C2
- CMP1_HP1 HN1 LP1 LN1
- CMP2_HP1 HN1 LP1 LN1
- CMP3_HP1 HN1 LP1 LN1
- CMP4_HP0 LP0
- HSEC_ADC-A8,PGA6_OF
- CMP6_HP0 LP0
- C5 Only on 377-Ball ZWT
- ADC-C3
- ADC-C4, COMP+
- ADC-C5
- (near R22) D5 Only on 377-Ball ZWT
- ADC-D2, COMP+
- ADC-D3
- ADC-D4
- ADC-D5
- HSEC_ADC-C4
- HSEC_ADC-C14
- CMP5_HP1 HN1 LP1 LN1
- CMP7_HP1 HN1 LP1 LN1
- GPIO.00
- GPIO.01
- GPIO.04
- GPIO.05
- GPIO.02
- GPIO.03
- GPIO.08
- GPIO.09
- GPIO.06
- GPIO.07
- GPIO.12
- GPIO.13
- GPIO.10
- GPIO.11
- GPIO.16
- GPIO.17
- GPIO.14
- GPIO.15
- GPIO.20
- GPIO.21
- EPWM11A
- GPIO.18
- GPIO.19
- GPIO.24
- GPIO.25
- GPIO.26
- GPIO.22
- GPIO.23
- GPIO.28
- GPIO.29
- GPIO.30
- SCITXA
- SCIRXA
- EPWM12A
- GPIO.27
- GPIO.32
- GPIO.33
- GPIO.40
- (near R26) Extra GPIO
- Extra GPIO
- GPIO.34
- GPIO.39
- GPIO.44
- GPIO.31
- GPIO.41
- GPIO.42
- GPIO.43
- GPIO.48
- GPIO.45
- GPIO.46
- GPIO.47
- GPIO.54
- GPIO.49
- GPIO.50
- GPIO.51
- GPIO.52
- GPIO.53
- GPIO.55
- GPIO.56
- GPIO.57
- GPIO.58
- (near R59) GPIO.59
- (near R260) Input voltage monitoring
- External LED Strip, 3.3 or 5v
- Gain=13/93.6=0.139
  ADC range: 17.9v*0.139=2.5v
- Board Calibration Data
- ESP32 WiFi External Iface
- External Canbus
- Drawn By:
- SVN Rev:
- Number:
- TID #:
- Orderable:
- Rev:
- Sheet Title:
- File:
- Project Title:
- Designed for:
- Assembly Variant:
- Mod. Date:
- Sheet:
- Size:
- of
- C
- http://www.ti.com
- Texas Instruments and/or its licensors do not warrant the accuracy or completeness of this specification or any information contained therein. Texas Instruments and/or its licensors do not warrant that this design will meet the specifications, will be suitable for your application or fit for any particular purpose, or will operate in an implementation. Texas Instruments and/or its licensors do not warrant that the design is production worthy. You should completely validate and test your design implementation to confirm the system functionality for your application.
- Engineer:
- Contact:
- © Texas Instruments
- (in symbol ESP32_WLOIN) ESP-WROOM-32; LOLIN32; V1.0.0

## Library data of the parts
C32 C34 C173 C175 = Capacitor: CAP, CERM, 1 uF, 25 V, +/- 10%, X7R, 0603; Manufacturer: MuRata; Polarized: N; Value: 1uF; U/M: EA; Cap_F: 1µF; Value1: Unknown; TaMin_C: -55°C; TaMax_C: 125°C; AEC Category: Q200; SizeArea_mm2: 1.28; SizeAreaWB_mm2: 4.68; SizeX_mm: 1.6; SizeY_mm: 0.8; SizeZ_mm: 1; CompType: Capacitor; PartNumber: GRM188R71E105KA12D; PackageReference: 0603; RoHS: Y; Tolerance_%: 10%; MountType: SMT; Technology: Ceramic; TempCo: X7R; Cap_Case: 0603; Published: 2008-06-19; Publisher: Texas Instruments; LatestRevisionDate: 2017-03-09; ComponentLink1Description: Datasheet link; ComponentLink1URL: http://search.murata.co.jp/Ceramy/PnsearchViewAction.do?HnOFG=ON&HnNFG=ON&SEL_CNT=50&sLang=en&sKey=GRM188R71E105KA12D&x=9&y=9&search=startwith; Supplier 1: Digi-Key; Supplier Part Number 1: 490-5307-1-ND; Supplier 2: Mouser; Supplier Part Number 2: 81-GRM188R71E105KA2D; Supplier 3: Farnell; Supplier Part Number 3: 1735540; AEC Qualified: ?
  C32 C34 C173: Value2: 25V
  C175: VDC_V: 25V; Parameter 1: *
C124 C125 C135 C150 C195 = Capacitor: CAP, CERM, 1 uF, 25 V, +/- 10%, X7R, 0603; Manufacturer: MuRata; Polarized: N; Value: 1uF; U/M: EA; Cap_F: 1µF; Value1: Unknown; VDC_V: 25V; TaMin_C: -55°C; TaMax_C: 125°C; AEC Category: Q200; SizeArea_mm2: 1.28; SizeAreaWB_mm2: 4.68; SizeX_mm: 1.6; SizeY_mm: 0.8; SizeZ_mm: 1; CompType: Capacitor; PartNumber: GRM188R71E105KA12D; PackageReference: 0603; RoHS: Y; Tolerance_%: 10%; Value2: 25V; MountType: SMT; Technology: Ceramic; TempCo: X7R; Cap_Case: 0603; Published: 2008-06-19; Publisher: Texas Instruments; LatestRevisionDate: 2017-03-09; ComponentLink1Description: Datasheet link; ComponentLink1URL: http://search.murata.co.jp/Ceramy/PnsearchViewAction.do?HnOFG=ON&HnNFG=ON&SEL_CNT=50&sLang=en&sKey=GRM188R71E105KA12D&x=9&y=9&search=startwith; Supplier 1: Digi-Key; Supplier Part Number 1: 490-5307-1-ND; Supplier 2: Mouser; Supplier Part Number 2: 81-GRM188R71E105KA2D; Supplier 3: Farnell; Supplier Part Number 3: 1735540; AEC Qualified: ?
C126 C169 = C0603C103J3GECAUTO: CAP, CERM, 0.01 µF, 25 V,+/- 5%, C0G/NP0, AEC-Q200 Grade 1, 0603; Manufacturer: Kemet; Polarized: N; CompType: Capacitor; Value: 0.01uF; U/M: EA; Cap_F: 0.00000001; Tolerance_%: 5; VDC_V: 25; Value2: 25V; TaMin_C: -55; TaMax_C: 125; SizeArea_mm2: 1.28; SizeAreaWB_mm2: 4.68; SizeX_mm: 1.6; SizeY_mm: 0.8; SizeZ_mm: 1; AEC Category: Q200; AEC Qualified: Y; SymbolVersion: 2008-07-09; PartNumber: C0603C103J3GECAUTO; PackageReference: 0603; RoHS: Y; MountType: SMT; Technology: Ceramic; TempCo: C0G/NP0; Cap_Case: 0603; Published: 2008-06-19; Publisher: Texas Instruments; LatestRevisionDate: 2017-06-22; ComponentLink1Description: Datasheet link; ComponentLink1URL: https://search.kemet.com/component-edge/download/datasheet/C0603C103J3GECAUTO.pdf; Supplier 1: Digi-Key; Supplier Part Number 1: 399-14102-1-ND; Supplier 2: Newark; Supplier Part Number 2: 06AC5972; Supplier 3: Mouser; Supplier Part Number 3: 80-C0603C103J3GEAUTO; AEC Grade: 1
C176 C194 C196-C198 = Capacitor: CAP, CERM, 0.1 uF, 25 V, +/- 5%, X7R, 0603; Manufacturer: AVX; Polarized: N; Value: 0.1uF; U/M: EA; Cap_F: 100nF; ESR_ohm: 0.05; Value1: 0.05 ohm; VDC_V: 25V; TaMin_C: -55°C; TaMax_C: 125°C; AEC Category: Q200; SizeArea_mm2: 1.28; SizeAreaWB_mm2: 4.68; SizeX_mm: 1.6; SizeY_mm: 0.8; SizeZ_mm: 1; CompType: Capacitor; PartNumber: 06033C104JAT2A; PackageReference: 0603; RoHS: Y; Tolerance_%: 5%; Value2: 25V; MountType: SMT; Technology: Ceramic; TempCo: X7R; Cap_Case: 0603; Published: 2008-06-19; Publisher: Texas Instruments; LatestRevisionDate: 2017-03-09; ComponentLink1Description: Datasheet link; ComponentLink1URL: http://datasheets.avx.com/X7RDielectric.pdf; Supplier 1: Digi-Key; Supplier Part Number 1: 478-3713-1-ND; Supplier 2: Mouser; Supplier Part Number 2: 581-06033C104JAT2A; Supplier 3: Farnell; Supplier Part Number 3: 1740614; AEC Qualified: N; AEC Grade: N/A
C186 = Capacitor: CAP, CERM, 0.1 uF, 25 V, +/- 5%, X7R, 0603; Manufacturer: AVX; Polarized: N; Value: 0.1uF; U/M: EA; ESR_ohm: 0.05; Value1: 0.05 ohm; TaMin_C: -55°C; TaMax_C: 125°C; AEC Category: Q200; SizeArea_mm2: 1.28; SizeAreaWB_mm2: 4.68; SizeX_mm: 1.6; SizeY_mm: 0.8; SizeZ_mm: 1; CompType: Capacitor; PartNumber: 06033C104JAT2A; PackageReference: 0603; RoHS: Y; Tolerance_%: 5%; VDC_V: 25V; MountType: SMT; Technology: Ceramic; TempCo: X7R; Cap_Case: 0603; Published: 2008-06-19; Publisher: Texas Instruments; LatestRevisionDate: 2017-03-09; ComponentLink1Description: Datasheet link; ComponentLink1URL: http://datasheets.avx.com/X7RDielectric.pdf; Supplier 1: Digi-Key; Supplier Part Number 1: 478-3713-1-ND; Supplier 2: Mouser; Supplier Part Number 2: 581-06033C104JAT2A; Supplier 3: Farnell; Supplier Part Number 3: 1740614; AEC Qualified: N; AEC Grade: N/A; ValueDisplayed: 0.1uF
CAN = Header 5: Header, 5-Pin; LatestRevisionDate: 17-Jul-2002; LatestRevisionNote: Re-released for DXP Platform.; Publisher: Altium Limited; PartNumber: Header 5
D12 D13 D16 D19-D25 = NSR0240V2T1G: Diode, Schottky, 40V, 0.25A, SOD-523; Manufacturer: ON Semiconductor; U/M: EA; Vf_V: 0.7; Value2: 0.7V; Io_A: 0.25; Vr_V: 40; TJmax_C: 150; RJC_CperW: 600; CompType: Diode; SymbolVersion: 2008-12-08; PartNumber: NSR0240V2T1G; PackageReference: SOD-523; Value: 40V; Value1: 0.25A; MountType: SMT; Type: Schottky; RoHS: Y; Published: 2008-06-26; Publisher: Texas Instruments; LatestRevisionDate: 2014-07-21; ComponentLink1Description: Datasheet link; ComponentLink1URL: http://www.onsemi.com/pub_link/Collateral/NSR0240V2T1-D.PDF; Supplier 1: Digi-Key; Supplier Part Number 1: NSR0240V2T1GOSCT-ND; Supplier 2: Mouser; Supplier Part Number 2: 863-NSR0240V2T1G; Supplier 3: Newark; Supplier Part Number 3: 46P8323
D33 = 150060VS75000: LED, Green, SMD; Manufacturer: Wurth Elektronik; Type: AlInGaP; Vf_V: 2; Value2: 2V; Io_A: 0.02; Value1: W; U/M: EA; CompType: LED; PartNumber: 150060VS75000; SymbolVersion: 2008-11-06; MountType: SMT; RoHS: Y; PackageReference: LED_0603; Color: green; Published: 2008-07-11; Publisher: Texas Instruments; ComponentLink1URL: http://katalog.we-online.de/led/datasheet/150060VS75000.pdf; ComponentLink1Description: Datasheet link; LatestRevisionDate: 2016-01-08; Supplier 1: Digi-Key; Supplier Part Number 1: 732-4980-1-ND
I2C = Header 3: Header, 3-Pin; LatestRevisionDate: 17-Jul-2002; LatestRevisionNote: Re-released for DXP Platform.; Publisher: Altium Limited; PartNumber: Header 3
J5 = HSEC8-160-01-X-RA-BL: 0.8MM HIGH SPEED ASSEMBLY.; Package: None; Price: None; Value: *; MP: HSEC8-160-01-X-RA-BL; Availability: Unavailable; PartNumber: HSEC8-160-01-L-RA-BL; Supplier 1: Newark; Supplier 2: Digi-Key
J6 J7 = 10 Pin ProgHeader: do not populate, RoHS compliant; ID: 908; PartNumber: 10 Pin ProgHeader
LED = Header 4: Header, 4-Pin; LatestRevisionDate: 17-Jul-2002; LatestRevisionNote: Re-released for DXP Platform.; Publisher: Altium Limited; PartNumber: Header 4
P1 = Header 15: Header, 15-Pin; LatestRevisionDate: 17-Jul-2002; LatestRevisionNote: Re-released for DXP Platform.; Publisher: Altium Limited; PartNumber: Header 15
P2 = Header 20: Header, 20-Pin; LatestRevisionDate: 17-Jul-2002; LatestRevisionNote: Re-released for DXP Platform.; Publisher: Altium Limited; PartNumber: Header 20
R22 R26 R43 R47-R55 R57 R58 R60 R162 R164 R165 R173 R187 R220 R222 R245-R257 R261-R276 R278 R281 R283 R289 R293-R297 R300 R310 R311 R313-R315 = CRCW04020000Z0ED: RES, 0, 5%, 0.063 W, 0402; Manufacturer: Vishay-Dale; CompType: Resistor; Value: 0; Value_Code: 0000; Tolerance_%: 5; Power_W: 0.063; Value2: 0.063W; VDC_V: 50; TempCo: 200 ppm/C; SizeArea_mm2: 0.5; SizeX_mm: 1; SizeZ_mm: 0.6; EIA_Code: E24; U/M: EA; AEC Category: Q200; Green_Lifecycle: Active; Green_REACh: Passed; SymbolVersion: 2009-05-29; PartNumber: CRCW04020000Z0ED; PackageReference: 0402; RoHS: Y; Res_ohm: 0; Value1: 5%; MountType: SMT; Technology: Thick Film; SizeY_mm: 0.5; Published: 2008-06-26; Publisher: Texas Instruments; LatestRevisionDate: 2017-06-12; ComponentLink1Description: Datasheet link; ComponentLink1URL: http://www.vishay.com/docs/20035/dcrcwe3.pdf; Supplier 1: Digi-Key; Supplier Part Number 1: 541-0.0JCT-ND; Supplier 2: Newark; Supplier Part Number 2: 52K6543; Supplier 3: Mouser; Supplier Part Number 3: 71-CRCW0402-0-E3; AEC Qualified: ?; Green_EU RoHS: Passed with Exemption; Green_EU RoHS-2: Passed
R23 R27 R56 R239 R277 R279 R280 R282 R284-R286 R288 R292 R298 R312 = FC0402E50R0BST1: RES, 50, 0.1%, 0.05 W, 0402; Manufacturer: Vishay-Dale; CompType: Resistor; Value: 50; Value_Code: 50R0; Tolerance_%: 0.1; Power_W: 0.05; Value2: 0.05W; TempCo: 25 ppm/C; SizeArea_mm2: 0.5; SizeX_mm: 1; SizeZ_mm: 0.6; U/M: EA; AEC Category: Q200; AEC Qualified: N; SymbolVersion: 2009-05-29; PartNumber: FC0402E50R0BST1; PackageReference: 0402; RoHS: Y; Res_ohm: 50; Value1: 0.1%; MountType: SMT; Technology: Thin Film; SizeY_mm: 0.5; Published: 2008-06-26; Publisher: Texas Instruments; LatestRevisionDate: 2017-06-12; ComponentLink1Description: Datasheet link; ComponentLink1URL: http://www.vishay.com/docs/60093/fcseries.pdf; Supplier 1: Digi-Key; Supplier Part Number 1: FC0402-50BWCT-ND; Supplier 2: Newark; Supplier Part Number 2: 41R5603; Supplier 3: Mouser; Supplier Part Number 3: 71-FC0402E50R0BST1; AEC Grade: N/A
R59 R316 = CRCW06034K99FKEA: RES, 4.99 k, 1%, 0.1 W, 0603; Manufacturer: Vishay-Dale; CompType: Resistor; Value: 4.99k; Res_ohm: 4990; Value_Code: 4k99; Tolerance_%: 1; Power_W: 0.1; Value2: 0.1W; VDC_V: 75; TempCo: 100 ppm/C; EIA_Code: E96; U/M: EA; SymbolVersion: 2009-05-29; PartNumber: CRCW06034K99FKEA; PackageReference: 0603; RoHS: Y; Value1: 1%; MountType: SMT; Technology: Thick Film; Published: 2008-06-26; Publisher: Texas Instruments; LatestRevisionDate: 2015-06-13; ComponentLink1Description: Datasheet link; ComponentLink1URL: http://www.vishay.com/docs/20035/dcrcwe3.pdf; Supplier 1: Digi-Key; Supplier Part Number 1: 541-4.99KHCT-ND; Supplier 2: Mouser; Supplier Part Number 2: 71-CRCW0603-4.99K-E3; Supplier 3: Farnell; Supplier Part Number 3: 1652885
R223-R238 R240-R242 R244 R258 R259 = CRCW040210K0FKED: RES, 10.0 k, 1%, 0.063 W, 0402; Manufacturer: Vishay-Dale; CompType: Resistor; Value: 10.0k; Res_ohm: 10000; Value_Code: 10k0; Tolerance_%: 1; Power_W: 0.063; Value2: 0.063W; VDC_V: 50; TempCo: 100 ppm/C; SizeArea_mm2: 0.5; SizeZ_mm: 0.6; EIA_Code: E96; U/M: EA; AEC Category: Q200; Green_Lifecycle: Active; Green_REACh: Passed; SymbolVersion: 2009-05-29; PartNumber: CRCW040210K0FKED; PackageReference: 0402; RoHS: Y; Value1: 1%; MountType: SMT; Technology: Thick Film; SizeX_mm: 1; SizeY_mm: 0.5; Published: 2008-06-26; Publisher: Texas Instruments; LatestRevisionDate: 2017-06-12; ComponentLink1Description: Datasheet link; ComponentLink1URL: http://www.vishay.com/docs/20035/dcrcwe3.pdf; Supplier 1: Digi-Key; Supplier Part Number 1: 541-10.0KLCT-ND; Supplier 2: Newark; Supplier Part Number 2: 52K6595; Supplier 3: Mouser; Supplier Part Number 3: 71-CRCW0402-10K-E3; AEC Qualified: ?; Green_EU RoHS: Passed with Exemption; Green_EU RoHS-2: Passed
R243 = Res3: Published: 8-Jun-2000; LatestRevisionDate: 29-May-2009; LatestRevisionNote: IPC-7351 Footprint Added.; PackageReference: J1-0603; Publisher: Altium Limited; PackageDescription: Chip Resistor; PartNumber: 120 Ohm 1210
R260 R303 = Resistor: RES, 13 k, 0.1%, 0.1 W, 0603; Manufacturer: Yageo America; Power_W: 100mW; TempCo: 25 ppm/C; U/M: EA; Value: 13k; SizeX_mm: 1.6; SizeY_mm: 0.8; SizeZ_mm: 1; Value2: 0.1W; SizeArea_mm2: 1.28; VDC_V: 75V; AEC Category: Q200; EIA_Code: E192; Publisher: Texas Instruments; Published: 2008-06-26; Value_Code: 13k; RoHS: Y; Value1: 0.1%; MountType: SMT; PackageReference: 0603; Tolerance_%: 0.1%; Res_ohm: 13k; CompType: Resistor; LatestRevisionDate: 2017-03-09; AEC Qualified: ?; Technology: Thin Film; PartNumber: ERJ-3EKF1302V
R299 R301 = Resistor: RES, 80.6 k, 0.1%, 0.1 W, 0603; Manufacturer: Yageo America; Power_W: 100mW; TempCo: 25 ppm/C; U/M: EA; Value: 100k; EIA_Code: E192; SizeX_mm: 1.6; SizeY_mm: 0.8; SizeZ_mm: 1; Value2: 0.1W; SizeArea_mm2: 1.28; VDC_V: 75V; AEC Category: Q200; Publisher: Texas Instruments; Published: 2008-06-26; Value_Code: 80.6k; RoHS: Y; Value1: 0.1%; MountType: SMT; Supplier 1: Mouser; PackageReference: 0603; Tolerance_%: 0.1%; Res_ohm: 80.6k; CompType: Resistor; LatestRevisionDate: 2017-03-09; AEC Qualified: ?; ComponentLink1Description: Datasheet link; Technology: Thin Film; ComponentLink1URL: http://www.yageo.com/pdf/PYu-RT_1-to-0.05_RoHS_L_3.pdf; PartNumber: RG1608P-8062-B-T5
R306-R309 R317 R318 = Resistor: RES, 100 k, 1%, 0.1 W, 0603; Manufacturer: Yageo; Power_W: 100mW; TempCo: 100 ppm/C; Value: 100k; EIA_Code: E96; SizeX_mm: 1.6; SizeY_mm: 0.8; SizeZ_mm: 1; Value2: 0.1W; SizeArea_mm2: 1.28; AEC Qualified: N; VDC_V: 75V; AEC Category: Q200; SizeAreaWB_mm2: 4.68; Supplier Part Number 2: 603-RC0603FR-07100KL; Supplier 2: Mouser; Supplier Part Number 3: 9238727; Supplier 3: Farnell; Value_Code: 100k; RoHS: Y; Value1: 1%; MountType: SMT; Supplier 1: Digi-Key; PackageReference: 0603; Tolerance_%: 1%; Res_ohm: 100k; CompType: Resistor; PartNumber: RC0603FR-07100KL; ComponentLink1Description: Datasheet link; Supplier Part Number 1: 311-100KHRCT-ND; Technology: Thick Film; ComponentLink1URL: http://www.yageo.com/pdf/Pu-RC0603_51_PbFree_L_2.pdf; AEC Grade: N/A
R319 R321 R323 R325 R327 R328 R330 R332 R334 = Resistor: RES, 100 k, 0.1%, 0.1 W, 0603; Manufacturer: Yageo America; Power_W: 100mW; TempCo: 25 ppm/C; U/M: EA; Value: 100k; EIA_Code: E192; SizeX_mm: 1.6; SizeY_mm: 0.8; SizeZ_mm: 1; Value2: 0.1W; SizeArea_mm2: 1.28; VDC_V: 75V; AEC Category: Q200; Publisher: Texas Instruments; Published: 2008-06-26; Value_Code: 100k; RoHS: Y; Value1: 0.1%; MountType: SMT; Supplier 1: Mouser; PackageReference: 0603; Tolerance_%: 0.1%; Res_ohm: 100k; CompType: Resistor; LatestRevisionDate: 2017-03-09; PartNumber: RT0603BRD07100KL; AEC Qualified: ?; ComponentLink1Description: Datasheet link; Supplier Part Number 1: 603-RT0603BRD07100KL; Technology: Thin Film; ComponentLink1URL: http://www.yageo.com/pdf/PYu-RT_1-to-0.05_RoHS_L_3.pdf
R320 R322 R324 R326 R329 R331 R333 R335 = CRCW060349K9FKEA: RES, 49.9 k, 1%, 0.1 W, 0603; Manufacturer: Vishay-Dale; CompType: Resistor; Value: 49.9k; Res_ohm: 49900; Value_Code: 49k9; Tolerance_%: 1; Power_W: 0.1; Value2: 0.1W; VDC_V: 75; TempCo: 100 ppm/C; SizeArea_mm2: 1.28; SizeX_mm: 1.6; SizeY_mm: 0.8; EIA_Code: E96; U/M: EA; AEC Category: Q200; Green_Lifecycle: Active; Green_REACh: Passed; SymbolVersion: 2009-05-29; PartNumber: CRCW060349K9FKEA; PackageReference: 0603; RoHS: Y; Value1: 1%; MountType: SMT; Technology: Thick Film; SizeZ_mm: 1; Published: 2008-06-26; Publisher: Texas Instruments; LatestRevisionDate: 2017-06-13; ComponentLink1Description: Datasheet link; ComponentLink1URL: http://www.vishay.com/docs/20035/dcrcwe3.pdf; Supplier 1: Digi-Key; Supplier Part Number 1: 541-49.9KHCT-ND; Supplier 2: Mouser; Supplier Part Number 2: 71-CRCW0603-49.9K-E3; Supplier 3: Farnell; Supplier Part Number 3: 1652882; AEC Qualified: ?; Green_EU RoHS: Passed with Exemption; Green_EU RoHS-2: Passed
S4 S5 = SW_8SPST: Switch, SPST, 8 Pos, 25mA, 24VDC, SMD; Manufacturer: CTS Electrocomponents; CurrentRating_mA: 25A; PositionCount: 8; VDC_V: 24V; SwitchFunction: Off-On; Supplier 2: Mouser; Supplier 1: Digi-Key; Supplier Part Number 1: CT2188LPST-ND; Supplier Part Number 2: 774-2188LPST; PartNumber: 218-8LPST; ComponentLink1Description: Datasheet Link; LatestRevisionDate: 2017-03-09; ComponentLink1URL: http://www.ctscorp.com/components/Datasheets/218.pdf; CompType: Switch; PackageReference: 11.33x5.8mm; Publisher: Texas Instruments; Circuit: SPST; RoHS: Y; Orientation: Top Actuated; MountType: SMT
S6 = Switch_PushButton: Switch, Tactile, SPST-NO, 0.05A, 12V, SMT; PartNumber: TL1015AF160QG; Manufacturer: E-Switch; SwitchFunction: Off-Mom; PositionCount: 1; CurrentRating_mA: 50A; MountType: SMT; ComponentLink1Description: Datasheet URL; ComponentLink1URL: http://spec.e-switch.com/P-J/P420000.pdf; RoHS: Y; Circuit: SPST-NO; VDC_V: 12V; Orientation: Top Actuated; CompType: Switch; PackageReference: Switch, 4.4x2x2.9 mm; Publisher: Texas Instruments; LatestRevisionDate: 2017-03-09; Supplier 1: Digi-Key; Supplier Part Number 1: EG4344CT-ND; Supplier 2: Newark; Supplier Part Number 2: 15N4458; Supplier 3: Mouser; Supplier Part Number 3: 612-TL1015AF
TP41 = 5001: Test Point, Miniature, Black, TH; Manufacturer: Keystone; CompType: Test Point Loop; ContactFinish: Silver; Green_Lifecycle: Active; Green_REACh: Passed; SymbolVersion: 2008-04-04; PartNumber: 5001; PackageReference: Black Miniature Testpoint; RoHS: Y; MountType: TH; ComponentLink1Description: Datasheet URL; ComponentLink1URL: http://www.keyelco.com/userAssets/file/M60-2p60.pdf; Color: Black; Publisher: Texas Instruments; LatestRevisionDate: 2017-05-11; Supplier 1: Digi-Key; Supplier Part Number 1: 36-5001-ND; Supplier 2: Mouser; Supplier Part Number 2: 534-5001; Green_EU RoHS: Passed; Green_EU RoHS-2: Incomplete
U14 = OpAmp_Single_SOTSTD: 36V, Low-Power, RRO, General-Purpose Operational Amplifier, DBV0005A (SOT-23-5); Alternate PartNumber: TLV171IDBVT; Alternate Manufacturer: Texas Instruments; SizeAreaWB_mm2: 14.82; U/M: EA; SizeZ_mm: 1.45; SizeX_mm: 2.8; SizeY_mm: 2.9; SizeArea_mm2: 8.12; CompType: IC; ComponentLink1URL: http://www.ti.com/lit/ds/symlink/tlv171.pdf; Publisher: Texas Instruments; PackageDescription: SOT-23-5; RoHS: Y; Footprint Path 6: C:\AltiumLibraries\Footprints\TI\.PcbLib; MountType: SMT; Manufacturer: Texas Instruments; PackageReference: DBV0005A; LatestRevisionDate: 2017-06-09; PartNumber: TLV171IDBVR; ComponentLink1Description: Datasheet Link
U17 = CC3220MODA: CC3220MODASF12MONR - IC RF TxRx + MCU WiFi 802.11b/g/n 2.4GHz 63-SMD Module, RoHS compliant; id: 38385; PartNumber: CC3220MODA
U18 = TI-SN74XXX2GXXX-6_A-SCHMITT: Dual Schmitt-Trigger Buffer, DBV0006A, SMALL T&R; Manufacturer: Texas Instruments; Output Type: CMOS; Logic: True; Input Type: CMOS/TTL; F @ Nom Voltage(Max)(Mhz): 150; Rating: Catalog; Sub-Family: Non-Inverting Buffer/Driver; Output Drive (IOL/IOH)(Max)(mA): 32/-32; VCC(Min)(V): 1.65; Schmitt Trigger: Yes; tpd @ Nom Voltage(Max)(ns): 9.3,5.7,5.4,4.3; Technology Family: LVC; Voltage(Nom)(V): 1.8,2.5,3.3,5; VCC(Max)(V): 5.5; ICC @ Nom Voltage(Max)(mA): 0.01; 3-State Output: No; Bits(#): 2; Generic Part Number: SN74LVC2G17; Operating Temperature Range(C): -40 to 125,-40 to 85; PackageReference: DBV0006A; DatasheetVersion: SCES381N; PartNumber: SN74LVC2G17DBVT
U24 U28 = CMP-0777-00129-3: Quadruple 2-Input Positive-AND Gate, DB0014A, LARGE T&R; Manufacturer: Texas Instruments; Schmitt Trigger: No; Output Drive (IOL/IOH)(Max)(mA): -24/24; Bits(#): 4; Output Type: TTL; VCC(Max)(V): 3.6; Voltage(Nom)(V): 1.8,2.5,2.7,3.3; Rating: Catalog; ICC @ Nom Voltage(Max)(mA): 0.01; Technology Family: LVC; VCC(Min)(V): 1.65; F @ Nom Voltage(Max)(Mhz): 70; tpd @ Nom Voltage(Max)(ns): 9.8,6.9,4.8,4.1; PackageReference: DB0014A; DatasheetVersion: SCAS283Q; Generic Part Number: SN74LVC08A; Input Type: TTL; Operating Temperature Range(C): -40 to 125
U26 U27 = SYM-SN74HC148DR: Priority Encoder 1 x 8:3 16-SOIC; Manufacturer: Texas Instruments; SizeZ_mm: 1.75mm; AEC Qualified: No; ComponentLink1Description: Datasheet; ComponentLink1URL: http://www.ti.com/lit/ds/symlink/sn74hc148.pdf; PackageReference: SOIC16; PartNumber: SN74HC148DR; Operating Temperature Range: -40°C to +85°C; RoHS: TRUE; Symbol Name: SYM-SN74HC148DR
U34 = d0711c86b564d86c4b230fd196adeb8: IC FRAM 1M I2C 3.4MHZ 8SOIC; Memory Type: RAM; Max Supply Voltage: 3.6V; Memory Size: 1Mb; Nominal Supply Current: 1mA; Data Bus Width: 8b; Number of Words: 128000; Min Supply Voltage: 2V; Access Time: 450ns; Operating Supply Voltage: 3.3V; Max Operating Temperature: 85°C; Frequency: 3.4MHz; Min Operating Temperature: -40°C; Height: 1.478mm; Word Size: 8b; Case/Package: SOIC; Radiation Hardening: No; Weight: 0.019048oz; Mount: Surface Mount; Package Quantity: 100; Lead Free: Lead Free; Width: 3.987mm; Number of Pins: 8; Length: 4.98mm; Interface: I2C; Packaging: Rail/Tube; Density: 1Mb; PartNumber: FM24V10-G
U35 = TI-SN65HVD234-SOIC_D-8: 3.3V CAN Transceiver with Sleep Mode, 6 mA, -40 to 125 degC, 8-pin SOIC (D), Green (RoHS & no Sb/Br); Manufacturer: Texas Instruments; Transient Pulse Protection(V): -100 to 100; Rating: Catalog; Supply Voltage(s)(V): 3.3; ICC(Max)(mA): 6; Bus Fault Voltage(V): +/-30; Drivers Per Package: 1; PackageVersion: revM, Jun-2011; ComponentLink1Description: Datasheet; Eco-Plan: Green (RoHS & no Sb/Br); Mounting Technology: Surface Mount; ComponentLink1URL: http://www.ti.com/general/docs/lit/getliterature.tsp?genericPartNumber=SN65HVD234&fileType=pdf; PackageDescription: 8-Pin Plastic Small Outline Integrated Circuit, 4.9 x 3.9 mm, Pitch 1.27 mm Pitch; SubFamily: CAN; DatasheetVersion: SLLS557F; Footprint: PCA82C250, excludes pin5; Code_JEDEC: MS-012AA; PackageReference: D0008A; Low Power Mode: Sleep; PartNumber: SN65HVD234DR; Isolated: No; Receivers Per Package: 1
U39 = ESP32_WLOIN: PartNumber: ESP32 LOLIN32 V1.0.0